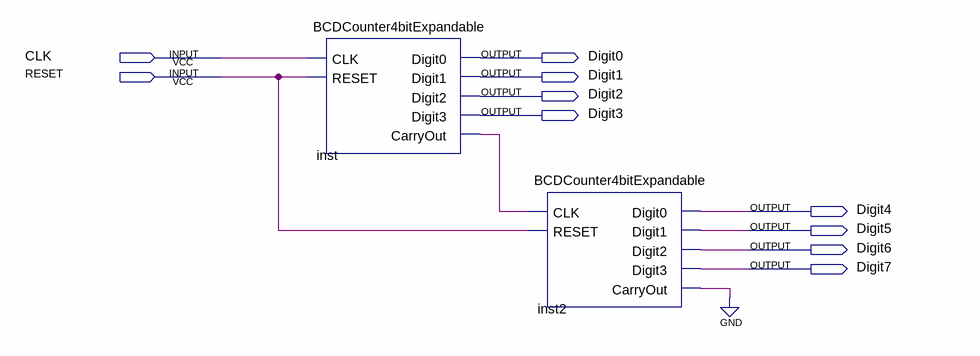
[diagram p0: schematic sheet]
// Quartus schematic BCDCounter8bit.bdf as structural Verilog: 2 symbols, 10 pins
module BCDCounter8bit (
  input  CLK,
  input  RESET,
  output Digit0,
  output Digit1,
  output Digit2,
  output Digit3,
  output Digit4,
  output Digit5,
  output Digit6,
  output Digit7
);

  wire inst2_carryout, inst_carryout;

  BCDCounter4bitExpandable inst (
    .CLK(CLK), .RESET(RESET), .Digit0(Digit0), .Digit1(Digit1), .Digit2(Digit2), .Digit3(Digit3),
    .CarryOut(inst_carryout));
  BCDCounter4bitExpandable inst2 (
    .CLK(inst_carryout), .RESET(RESET), .Digit0(Digit4), .Digit1(Digit5), .Digit2(Digit6), .Digit3(Digit7),
    .CarryOut(inst2_carryout));
  // also tied to GND on the sheet: inst2_carryout
endmodule
